# Altium schematic sheet ANA.SchDoc
size A4
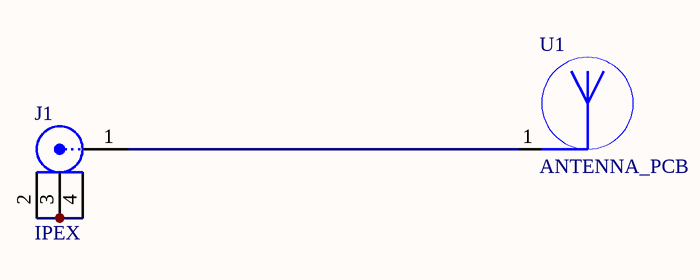
[diagram p0: ANA.SchDoc]

## Parts
J1  IPEX  [molex-73412]
U1  ANTENNA_PCB  [ANTENNA_DN024N]

## Nets
NetJ1_1: J1.1 U1.1
NetJ1_2: J1.2 J1.3 J1.4

## Library data of the parts
J1 = 73412-0110: RF同轴连接器（天线座）; Manufacturer: MOLEX; Code: 734120110; CompType: IPEX插座; DistributorCode: C434806; Package: SMD
U1 = ANTENNA_PCB: Manufacturer: -; Code: -; DistributorCode: -; Package: P1X1